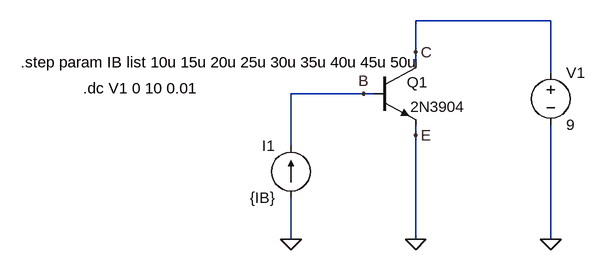
[diagram p0: schematic transister.asc]
transister.asc, the LTspice schematic file:
Version 4
SHEET 1 880 680
WIRE 384 0 176 0
WIRE 176 48 176 0
WIRE 176 64 176 48
WIRE 384 80 384 0
WIRE 96 112 -16 112
WIRE 112 112 96 112
WIRE 176 176 176 160
WIRE -16 192 -16 112
WIRE -16 336 -16 272
WIRE 176 336 176 176
WIRE 384 336 384 160
FLAG -16 336 0
FLAG 176 336 0
FLAG 384 336 0
FLAG 176 48 C
FLAG 96 112 B
FLAG 176 176 E
SYMBOL npn 112 64 R0
WINDOW 0 67 46 Bottom 2
SYMATTR InstName Q1
SYMATTR Value 2N3904
SYMBOL current -16 272 R180
WINDOW 0 24 80 Left 2
WINDOW 3 24 0 Left 2
SYMATTR InstName I1
SYMATTR Value {IB}
SYMBOL voltage 384 64 R0
WINDOW 123 0 0 Left 0
WINDOW 39 0 0 Left 0
SYMATTR InstName V1
SYMATTR Value 9
TEXT -432 64 Left 2 !.step param IB list 10u 15u 20u 25u 30u 35u 40u 45u 50u
TEXT -336 104 Left 2 !.dc V1 0 10 0.01

The netlist it stands for:
* transister.asc
Q1 C B 0 0 2N3904
I1 0 B {IB}
V1 C 0 9
.model NPN NPN
.model PNP PNP
.lib standard.bjt
.step param IB list 10u 15u 20u 25u 30u 35u 40u 45u 50u
.dc V1 0 10 0.01
.backanno
.end